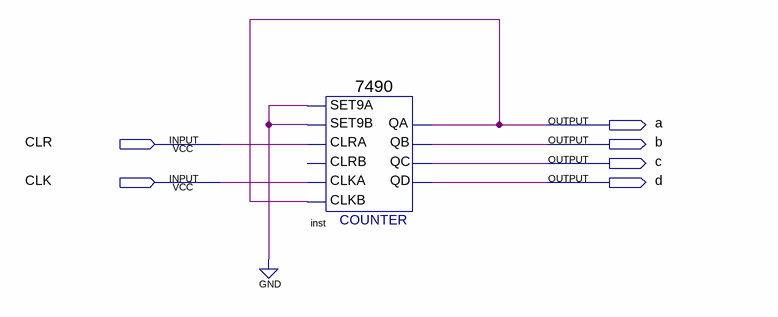
[diagram p0: schematic sheet]
// Quartus schematic BCD.bdf as structural Verilog: 1 symbols, 6 pins
module BCD (
  input  CLR,
  input  CLK,
  output a,
  output b,
  output c,
  output d
);

  \7490  inst (
    .SET9A(1'b0), .CLRA(CLR), .SET9B(1'b0), .CLKB(a), .CLKA(CLK), .QD(d), .QA(a), .QB(b), .QC(c));  // open: CLRB
endmodule
